# EAGLE design SlimPow-CB-v2 (EAGLE 6.5.0)
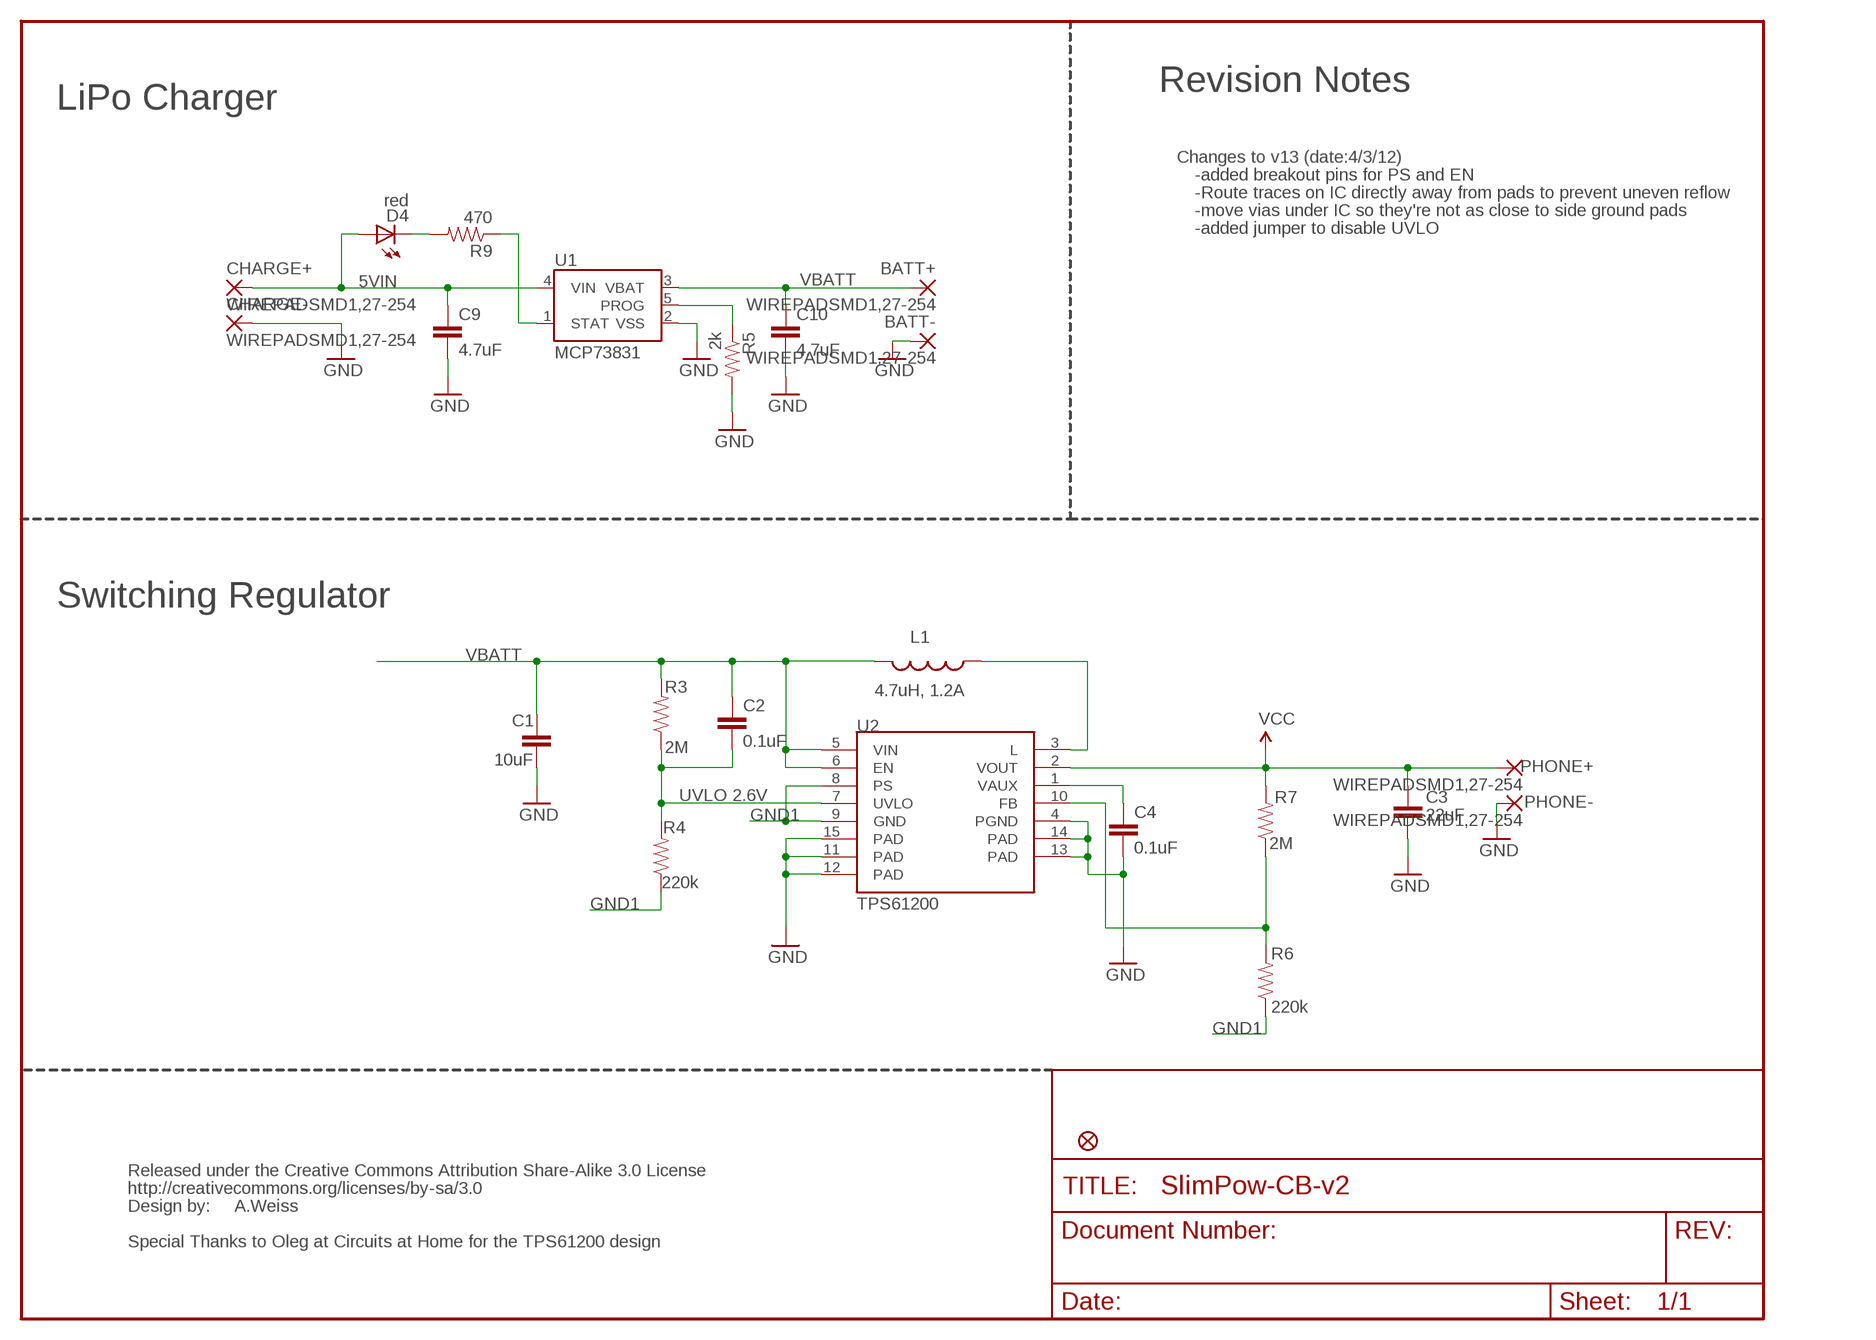
[diagram p0: schematic, sheet 1]

## Parts
BATT+  WIREPADSMD1,27-254  [SMD1,27-2,54]
BATT-  WIREPADSMD1,27-254  [SMD1,27-2,54]
C1  10uF  CAP1206  [1206]
C2  0.1uF  CAP0402-CAP  [0402-CAP]
C3  22uF  CAP0805  [0805]
C4  0.1uF  CAP0402-CAP  [0402-CAP]
C9  4.7uF  CAP0402-CAP  [0402-CAP]
C10  4.7uF  CAP0402-CAP  [0402-CAP]
CHARGE+  WIREPADSMD1,27-254  [SMD1,27-2,54]
CHARGE-  WIREPADSMD1,27-254  [SMD1,27-2,54]
D4  red  LED0603  [LED-0603]
JP15  FIDUCIALUFIDUCIAL  [MICRO-FIDUCIAL]
L1  4.7uH, 1.2A  INDUCTOR.  [CDRH2D09]
PHONE+  WIREPADSMD1,27-254  [SMD1,27-2,54]
PHONE-  WIREPADSMD1,27-254  [SMD1,27-2,54]
R3  2M  RESISTOR0402-RES  [0402-RES]
R4  220k  RESISTOR0402-RES  [0402-RES]
R5  2k  RESISTOR0402-RES  [0402-RES]
R6  220k  RESISTOR0402-RES  [0402-RES]
R7  2M  RESISTOR0402-RES  [0402-RES]
R9  470  RESISTOR0402-RES  [0402-RES]
U1  MCP73831  [SOT23-5]
U2  TPS61200  [QFN-10_PAD]
U$2  CREATIVE_COMMONS  [CREATIVE_COMMONS]

## Nets
5VIN: C9.1 CHARGE+.1(P) D4.A U1.4(VIN)
FB: R6.2 R7.1 U2.10(FB)
GND: BATT-.1(P) C1.2 C3.2 C4.2 C9.2 C10.2 CHARGE-.1(P) PHONE-.1(P) R5.2 U1.2(VSS) U2.4(PGND) U2.11(PAD) U2.12(PAD) U2.13(PAD) U2.14(PAD) U2.15(PAD)
GND1: R4.1 R6.1 U2.8(PS) U2.9(GND)
N$1: C4.1 U2.1(VAUX)
N$2: L1.P$1 U2.3(L)
N$8: D4.C R9.2
N$11: R5.1 U1.5(PROG)
N$14: R9.1 U1.1(STAT)
UVLO: C2.2 R3.1 R4.2 U2.7(UVLO)
VBATT: BATT+.1(P) C1.1 C2.1 C10.1 L1.P$2 R3.2 U1.3(VBAT) U2.5(VIN) U2.6(EN)
VCC: C3.1 PHONE+.1(P) R7.2 U2.2(VOUT)

## Notes on the sheet
- Revision Notes
- LiPo Charger
- Changes to v13 (date:4/3/12)
- -added breakout pins for PS and EN
- -Route traces on IC directly away from pads to prevent uneven reflow
- -move vias under IC so they're not as close to side ground pads
- -added jumper to disable UVLO
- Switching Regulator
- UVLO 2.6V
- A.Weiss
- Special Thanks to Oleg at Circuits at Home for the TPS61200 design

## Library data of the parts
BATT+ BATT- CHARGE+ CHARGE- PHONE+ PHONE- = wirepad:WIREPAD: Wire PAD connect wire on PCB
C1 C3 = CH_passive:CAP: Capacitor Standard 0603 ceramic capacitor, and 0.1" leaded capacitor.
C2 C4 C9 C10 = SparkFun:CAP: Capacitor Standard 0603 ceramic capacitor, and 0.1" leaded capacitor.
D4 = SparkFun:LED: LEDs Standard schematic elements and footprints for 5mm, 3mm, 1206, and 0603 sized LEDs. 5mm - Spark Fun Electronics SKU : COM-00529 (and others)
JP15 = SparkFun:FIDUCIAL: Fiducial Alignment Points Various fiducial points for machine vision alignment.
L1 = SparkFun:INDUCTOR: Inductors Basic Inductor/Choke - 0603 and 1206. Footprints are not proven and vary greatly between part numbers.
R3-R7 R9 = SparkFun:RESISTOR: Resistor Basic schematic elements and footprints for 0603, 1206, and PTH resistors.
U1 = SparkFun:MCP73831: Microchip's MCP73831 Miniature single cell, fully integrated Li-Ion, Li-polymer charge management controller http://ww1.microchip.com/downloads/en/DeviceDoc/21984a.pdf
U2 = SparkFun:TPS61200: DC to DC Booster
U$2 = SparkFun-Aesthetics:CREATIVE_COMMONS: Creative Commons License summary

## Board
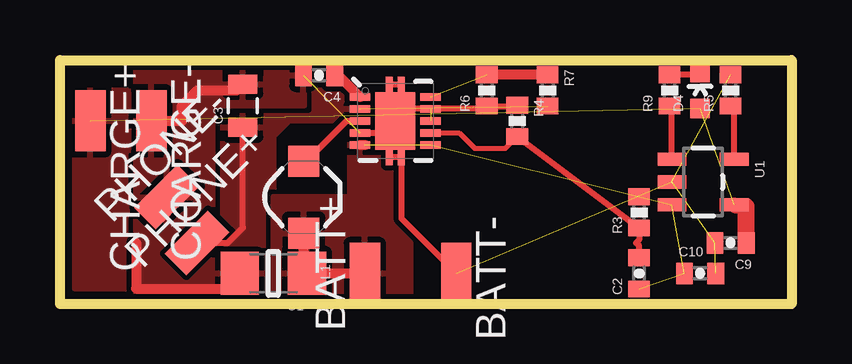
[diagram p1: board, top side]
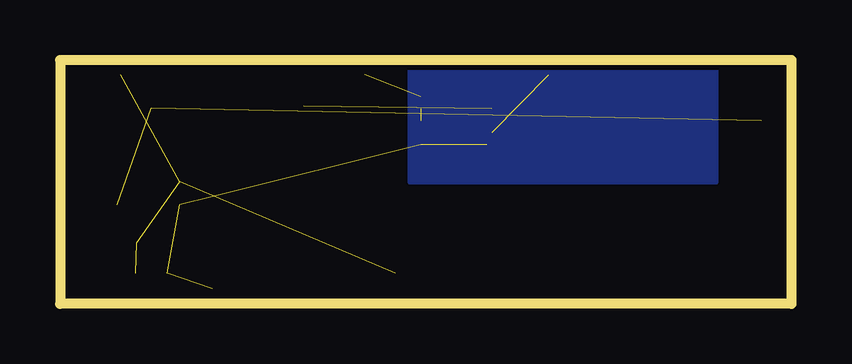
[diagram p2: board, bottom side, seen from below]

Size 30.48 x 10.16 mm. Coordinates in mm from the lower left corner, seen from the top.
Outline: 0,0 0,10.16 30.48,10.16 30.48,0 0,0
Copper layers (1*16): Top 0.035mm / dielectric 1.5mm / Bottom 0.035mm
Design rules "default": minimum track width 8mil, minimum drill 20mil, track to track 8mil, track to pad 8mil, pad to pad 8mil, via to via 8mil, smd to smd 8mil, copper to edge 8mil, drill to drill 8mil, minimum pad ring 12mil, minimum via ring 10mil, stop-mask expansion 4mil, vias tented up to drill 20mil, thermal gap 10mil

### Footprints (pad centres in the part's own frame; a part is rotated, then mirrored left to right if it is on the bottom)
SMD1,27-2,54 = smd 1.27 x 2.54: 1 0,0
1206 = smd 1.6 x 1.8: 1 -1.4,0; 2 1.4,0
0402-CAP = smd 0.7 x 0.9: 1 -0.65,0; 2 0.65,0
0805 = smd 0.8 x 1.2: 1 -0.9,0; 2 0.9,0
LED-0603 = smd 0.8 x 0.8: A 0,-0.75; C 0,0.75
MICRO-FIDUCIAL = smd 0.635 x 0.635: 1 0,0
CDRH2D09 = smd 1.3 x 1.3: P$1 -1.5,0; P$2 1.5,0
0402-RES = smd 0.7 x 0.9: 1 -0.65,0; 2 0.65,0
SOT23-5 = smd 0.55 x 1.2: 1 -0.95,-1.3; 2 0,-1.3; 3 0.95,-1.3; 4 0.95,1.3; 5 -0.95,1.3
QFN-10_PAD = smd 0.297 x 0.85: 1 -1,-1.475; 2 -0.5,-1.475; 3 0,-1.475; 4 0.5,-1.475; 5 1,-1.475; 6 1,1.475; 7 0.5,1.475; 8 0,1.475; 9 -0.5,1.475; 10 -1,1.475 | smd 0.7 x 0.28: 11 -1.5,0.25; 12 -1.5,-0.25; 13 1.5,0.25; 14 1.5,-0.25 | smd 2.4 x 1.65: 15 0,0

### Placement (x,y rotation side)
BATT+  12.7,1.27 0 top
BATT-  16.51,1.27 180 top
C1  8.89,1.27 180 top
C2  24.13,1.27 90 top
C3  7.62,8.26 90 top
C4  10.79,9.53 180 top
C9  27.94,2.54 180 top
C10  26.67,1.27 0 top
CHARGE+  1.27,7.62 180 top
CHARGE-  3.81,7.62 180 top
D4  26.67,8.89 0 top
JP15  22.86,39.37 90 top  (outside the outline)
L1  10.16,4.45 270 top
PHONE+  5.71,2.54 315 top
PHONE-  4.45,4.45 315 top
R3  24.13,3.81 90 top
R4  19.05,7.62 270 top
R5  27.94,8.89 90 top
R6  17.78,8.89 90 top
R7  20.32,8.89 270 top
R9  25.4,8.89 90 top
U1  26.8,5.08 270 top
U2  13.97,7.62 270 top
U$2  19.05,-10.16 0 top  (outside the outline)

### Tracks (layer width: path | path; a pad name or v marks a point on that pad's centre or on a via)
5VIN  (2 unrouted)
  Top 0.61: 28.59,4.05 28.57,4.06 28.16,4.06 U1.4
  Top 0.711: C9.1 28.59,4.05
  pour Top (rank 2): 0.64,8.89 2.54,8.89 3.17,8.89 3.17,8.26 3.17,0.64 0.64,0.64
FB  (1 unrouted)
  Top 0.406: R7.1 R6.2
GND  (5 unrouted)
  Top 0.254: U2.4 13.84,7.12 13.97,6.99 U2.15 | U2.15 13.72,7.87 U2.12 U2.11 | U2.13 14.22,3.56 BATT-.1 | U2.14 U2.13 | U2.13 14.22,7.37 U2.15
  Top 0.406: CHARGE-.1 5.08,7.62 5.08,8.26 5.71,8.89 7.36,8.89 C3.2 | PHONE-.1 4.45,3.81 | 3.17,2.54 3.17,0.64 6.99,0.64 6.99,0.77 C1.2
  pour Top (isolate 0.305, no thermals): 27.56,10.16 27.56,9.27 27.69,10.29
  pour Top: 3.17,10.16 10.16,10.16 10.16,8.26 6.35,8.26 6.35,2.54 6.99,1.91 8.89,1.91 8.89,0 3.17,0
GND1  (1 unrouted)
  Top 0.254: 14.61,8.13 14.61,8.12 U2.9 17.66,8.12 R6.1 19.02,8.24 R4.1
N$1
  Top 0.406: C4.1 11.59,9.53 U2.1
N$2
  Top 0.254: U2.3 11.94,7.62 10.16,5.84 L1.P$1
N$3
  pour Bottom: 3.17,10.16 3.17,5.08 15.88,5.08 15.88,10.16
N$8
  Top 0.254: R9.2 26.57,9.54 D4.C
N$11
  Top 0.254: U1.5 28.1,8.08 R5.1
N$14
  Top 0.254: U1.1 25.5,8.14 R9.1
UVLO
  Top 0.203: U2.7 16.63,7.12 17.27,6.48 18.56,6.48 R4.2
  Top 0.254: C2.2 24.13,2.41 24,2.54 24.13,2.67 R3.1 R4.2 18.9,7.12
VBATT  (5 unrouted)
  Top 0.406: L1.P$2 10.16,1.27 C1.1 BATT+.1 | U2.5 12.7,6.62
  pour Top: 8.89,4.45 8.89,0 14.61,0 14.61,2.54 13.97,3.81 13.97,5.71 13.34,6.99 12.06,6.99 12.06,4.45
VCC  (1 unrouted)
  Top 0.254: PHONE+.1 6.99,2.54 7.62,3.17 7.62,7.62
  pour Top (rank 3): 5.71,1.91 5.71,8.89 12.06,8.89 12.7,7.62 9.53,7.62 8.89,6.99 8.89,1.91